# EAGLE schematic shema_01 (EAGLE 6.5.0)
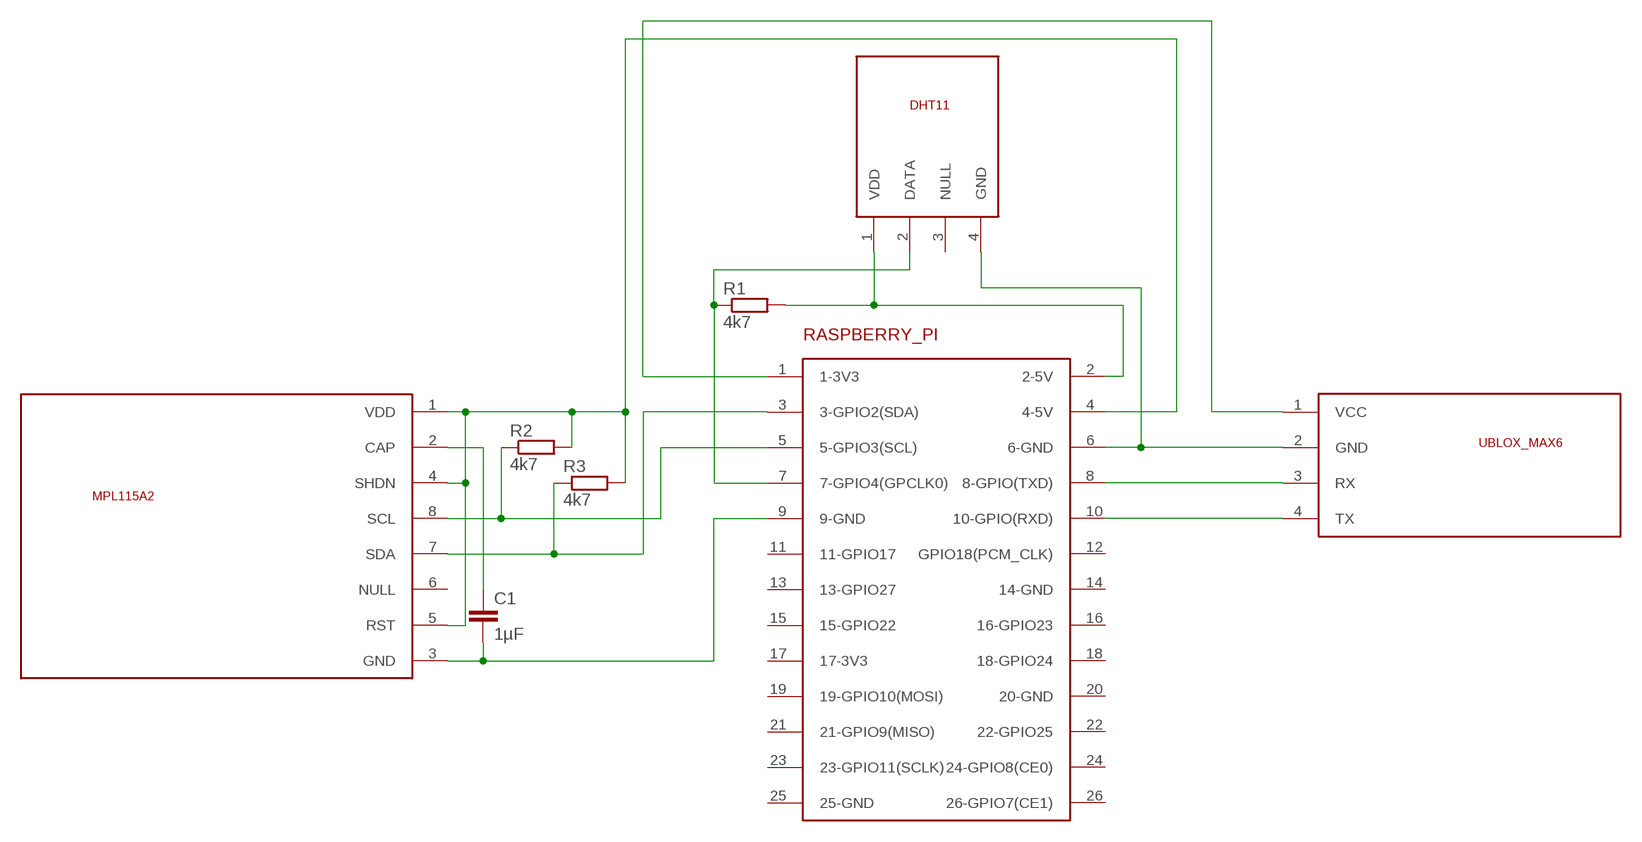
[diagram p0: schematic, sheet 1]

## Parts
C1  1µF  C2.5/6  [C2.5-6]
DHT11  DHT11  [DHT11]
MPL115A2  PRITISK  [PRITISK]
R1  4k7  R-EU_0207/12  [0207/12]
R2  4k7  R-EU_0309/10  [0309/10]
R3  4k7  R-EU_0309/10  [0309/10]
RASPBERRY_PI  RASPBERRY-PI  [RASPBERRY-PI]
UBLOX_MAX6  GPS  [GPS]

## Nets
N$1: DHT11.4(GND) RASPBERRY_PI.6(6-GND) UBLOX_MAX6.2(GND)
N$2: DHT11.1(VDD) R1.2 RASPBERRY_PI.2(2-5V)
N$3: DHT11.2(DATA) R1.1 RASPBERRY_PI.7(7-GPIO4(GPCLK0))
N$4: RASPBERRY_PI.8(8-GPIO(TXD)) UBLOX_MAX6.3(RX)
N$5: RASPBERRY_PI.10(10-GPIO(RXD)) UBLOX_MAX6.4(TX)
N$7: C1.1 MPL115A2.2(CAP)
N$8: MPL115A2.7(SDA) R3.1 RASPBERRY_PI.3(3-GPIO2(SDA))
N$9: C1.2 MPL115A2.3(GND) RASPBERRY_PI.9(9-GND)
N$10: RASPBERRY_PI.1(1-3V3) UBLOX_MAX6.1(VCC)
N$11: MPL115A2.8(SCL) R2.1 RASPBERRY_PI.5(5-GPIO3(SCL))
N$13: MPL115A2.1(VDD) MPL115A2.4(SHDN) MPL115A2.5(RST) R2.2 R3.2 RASPBERRY_PI.4(4-5V)
Unconnected: DHT11.3(NULL) MPL115A2.6(NULL) RASPBERRY_PI.11(11-GPIO17) RASPBERRY_PI.12(GPIO18(PCM_CLK)) RASPBERRY_PI.13(13-GPIO27) RASPBERRY_PI.14(14-GND) RASPBERRY_PI.15(15-GPIO22) RASPBERRY_PI.16(16-GPIO23) RASPBERRY_PI.17(17-3V3) RASPBERRY_PI.18(18-GPIO24) RASPBERRY_PI.19(19-GPIO10(MOSI)) RASPBERRY_PI.20(20-GND) RASPBERRY_PI.21(21-GPIO9(MISO)) RASPBERRY_PI.22(22-GPIO25) RASPBERRY_PI.23(23-GPIO11(SCLK)) RASPBERRY_PI.24(24-GPIO8(CE0)) RASPBERRY_PI.25(25-GND) RASPBERRY_PI.26(26-GPIO7(CE1))

## Library data of the parts
C1 = capacitor-wima:C: CAPACITOR naming: grid - package width
DHT11 = DHT11:DHT11; FIDO: none
MPL115A2 = 111matja_pritisk:PRITISK
R1 = rcl:R-EU_: RESISTOR, European symbol
R2 R3 = resistor:R-EU_: RESISTOR, European symbol
RASPBERRY_PI = RaspberryPi:RASPBERRY-PI: Raspberry Pi Board <http://www.raspberrypi.org/> Jacques Lagnel V1.0 (beta) 2012 Board dimension: Forum 3D model <http://www.raspberrypi.org/forum/general-discussion/mechanical-profile-3d-models?value=3d%20model&type=1&include=1&search=1&ret=all> The GPIO Connector (P1): http://elinux.org/RPi_Low-level_peripherals
UBLOX_MAX6 = 111GPS_matja:GPS